# EAGLE design two electrode ECG (EAGLE 7.4.0)
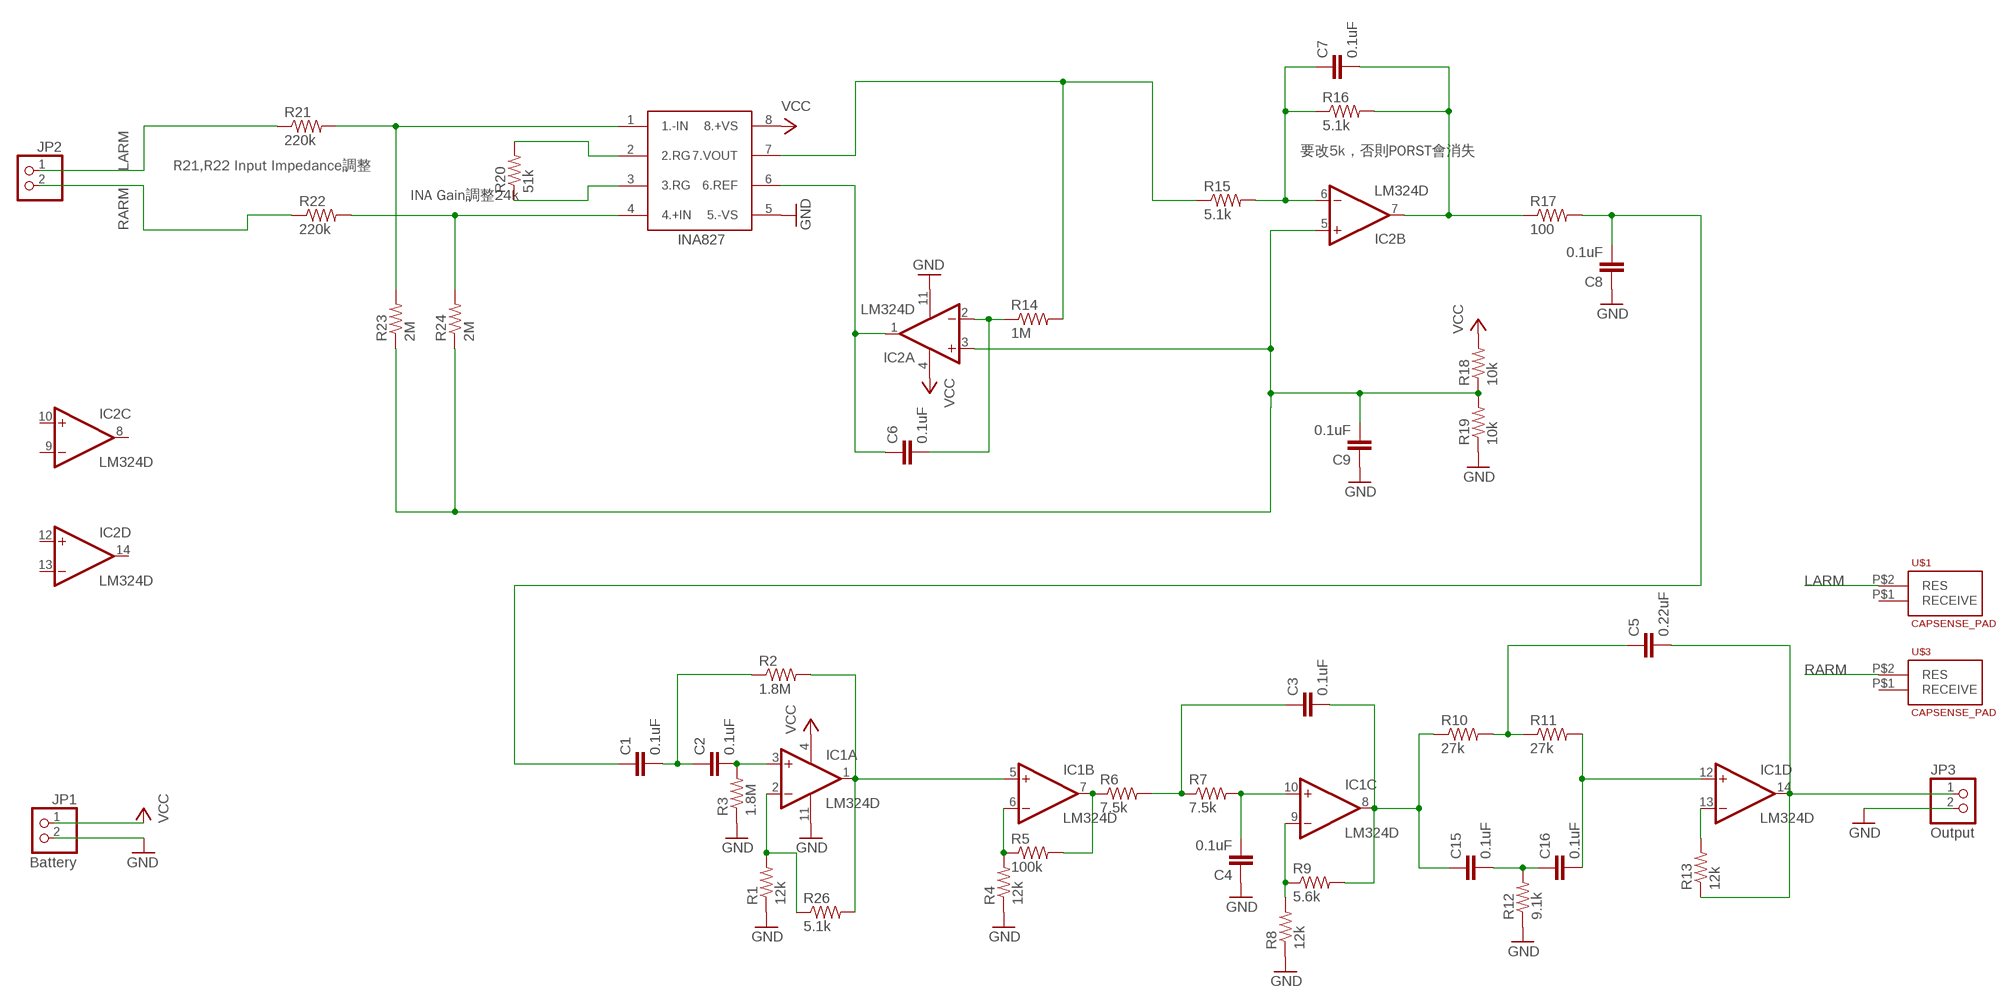
[diagram p0: schematic, sheet 1]

## Parts
C1  0.1uF  0.22UF-25V-10%(0603)  [0603-CAP]
C2  0.1uF  0.22UF-25V-10%(0603)  [0603-CAP]
C3  0.1uF  0.22UF-25V-10%(0603)  [0603-CAP]
C4  0.1uF  0.22UF-25V-10%(0603)  [0603-CAP]
C5  0.22uF  0.22UF-25V-10%(0603)  [0603-CAP]
C6  0.1uF  0.22UF-25V-10%(0603)  [0603-CAP]
C7  0.1uF  0.22UF-25V-10%(0603)  [0603-CAP]
C8  0.1uF  0.22UF-25V-10%(0603)  [0603-CAP]
C9  0.1uF  0.22UF-25V-10%(0603)  [0603-CAP]
C15  0.1uF  0.22UF-25V-10%(0603)  [0603-CAP]
C16  0.1uF  0.22UF-25V-10%(0603)  [0603-CAP]
IC1  LM324D  [SO14]
IC2  LM324D  [SO14]
JP1  Battery  PINHD-1X2  [1X02]
JP2  PINHD-1X2  [1X02]
JP3  Output  PINHD-1X2  [1X02]
R1  12k  1.2MOHMS-1/10W-1%(0603)  [0603-RES]
R2  1.8M  1.2MOHMS-1/10W-1%(0603)  [0603-RES]
R3  1.8M  1.2MOHMS-1/10W-1%(0603)  [0603-RES]
R4  12k  1.2MOHMS-1/10W-1%(0603)  [0603-RES]
R5  100k  1.2MOHMS-1/10W-1%(0603)  [0603-RES]
R6  7.5k  1.2MOHMS-1/10W-1%(0603)  [0603-RES]
R7  7.5k  1.2MOHMS-1/10W-1%(0603)  [0603-RES]
R8  12k  1.2MOHMS-1/10W-1%(0603)  [0603-RES]
R9  5.6k  1.2MOHMS-1/10W-1%(0603)  [0603-RES]
R10  27k  1.2MOHMS-1/10W-1%(0603)  [0603-RES]
R11  27k  1.2MOHMS-1/10W-1%(0603)  [0603-RES]
R12  9.1k  1.2MOHMS-1/10W-1%(0603)  [0603-RES]
R13  12k  1.2MOHMS-1/10W-1%(0603)  [0603-RES]
R14  1M  1.2MOHMS-1/10W-1%(0603)  [0603-RES]
R15  5.1k  1.2MOHMS-1/10W-1%(0603)  [0603-RES]
R16  5.1k  1.2MOHMS-1/10W-1%(0603)  [0603-RES]
R17  100  1.2MOHMS-1/10W-1%(0603)  [0603-RES]
R18  10k  1.2MOHMS-1/10W-1%(0603)  [0603-RES]
R19  10k  1.2MOHMS-1/10W-1%(0603)  [0603-RES]
R20  51k  1.2MOHMS-1/10W-1%(0603)  [0603-RES]
R21  220k  1.2MOHMS-1/10W-1%(0603)  [0603-RES]
R22  220k  1.2MOHMS-1/10W-1%(0603)  [0603-RES]
R23  2M  1.2MOHMS-1/10W-1%(0603)  [0603-RES]
R24  2M  1.2MOHMS-1/10W-1%(0603)  [0603-RES]
R26  5.1k  1.2MOHMS-1/10W-1%(0603)  [0603-RES]
U$1  CAPSENSE_PAD  [CAPSENSE_PAD]
U$2  INA827  [INA827]
U$3  CAPSENSE_PAD  [CAPSENSE_PAD]

## Nets
GND: C4.1 C8.1 C9.1 IC1.11(P:V-) IC2.11(P:V-) JP1.2 JP3.2 R1.1 R3.1 R4.1 R8.1 R12.1 R19.1 U$2.5(5.-VS)
LARM: JP2.1 R21.1 U$1.P$2(RES)
N$1: R20.2 U$2.2(2.RG)
N$2: C6.2 IC2.2(A:-IN) R14.1
N$3: R14.2 R15.1 U$2.7(7.VOUT)
N$4: C2.2 IC1.3(A:+IN) R3.2
N$5: R21.2 R23.2 U$2.1(1.-IN)
N$6: C1.2 C2.1 R2.1
N$7: IC1.1(A:OUT) IC1.5(B:+IN) R2.2 R26.2
N$8: IC1.2(A:-IN) R1.2 R26.1
N$9: C3.1 R6.2 R7.1
N$10: IC1.6(B:-IN) R4.2 R5.1
N$11: IC1.7(B:OUT) R5.2 R6.1
N$12: C4.2 IC1.10(C:+IN) R7.2
N$13: C3.2 C15.1 IC1.8(C:OUT) R9.2 R10.1
N$14: IC1.9(C:-IN) R8.2 R9.1
N$15: C5.1 R10.2 R11.1
N$16: C16.2 IC1.12(D:+IN) R11.2
N$17: C15.2 C16.1 R12.2
N$18: IC1.13(D:-IN) R13.2
N$19: C5.2 IC1.14(D:OUT) JP3.1 R13.1
N$20: C6.1 IC2.1(A:OUT) U$2.6(6.REF)
N$21: C7.1 IC2.6(B:-IN) R15.2 R16.1
N$22: C7.2 IC2.7(B:OUT) R16.2 R17.1
N$23: C1.1 C8.2 R17.2
N$24: C9.2 IC2.3(A:+IN) IC2.5(B:+IN) R18.1 R19.2 R23.1 R24.1
N$25: R20.1 U$2.3(3.RG)
N$26: R22.2 R24.2 U$2.4(4.+IN)
RARM: JP2.2 R22.1 U$3.P$2(RES)
VCC: IC1.4(P:V+) IC2.4(P:V+) JP1.1 R18.2 U$2.8(8.+VS)
Unconnected: IC2.8(C:OUT) IC2.9(C:-IN) IC2.10(C:+IN) IC2.12(D:+IN) IC2.13(D:-IN) IC2.14(D:OUT) U$1.P$1(RECEIVE) U$3.P$1(RECEIVE)

## Notes on the sheet
- 要改5k，否則PORST會消失
- R21,R22 Input Impedance調整
- INA Gain調整24k

## Library data of the parts
C1-C4 C6-C9 C15 C16 = SparkFun-Capacitors:0.22UF-25V-10%(0603): CAP-07822; PROD_ID: CAP-07822; VALUE: 0.22uF
C5 = SparkFun-Capacitors:0.22UF-25V-10%(0603): CAP-07822; PROD_ID: CAP-07822
IC1 IC2 = linear:LM324: OP AMP
JP1-JP3 = pinhead:PINHD-1X2: PIN HEADER
R1-R24 R26 = SparkFun-Resistors:1.2MOHMS-1/10W-1%(0603): RES-10055; PROD_ID: RES-10055; VALUE: 1.2M
U$1 U$3 = SparkFun-Electromechanical:CAPSENSE_PAD: Generic copper pad for a capacitive touch sensor.
U$2 = INA827:INA827

## Board
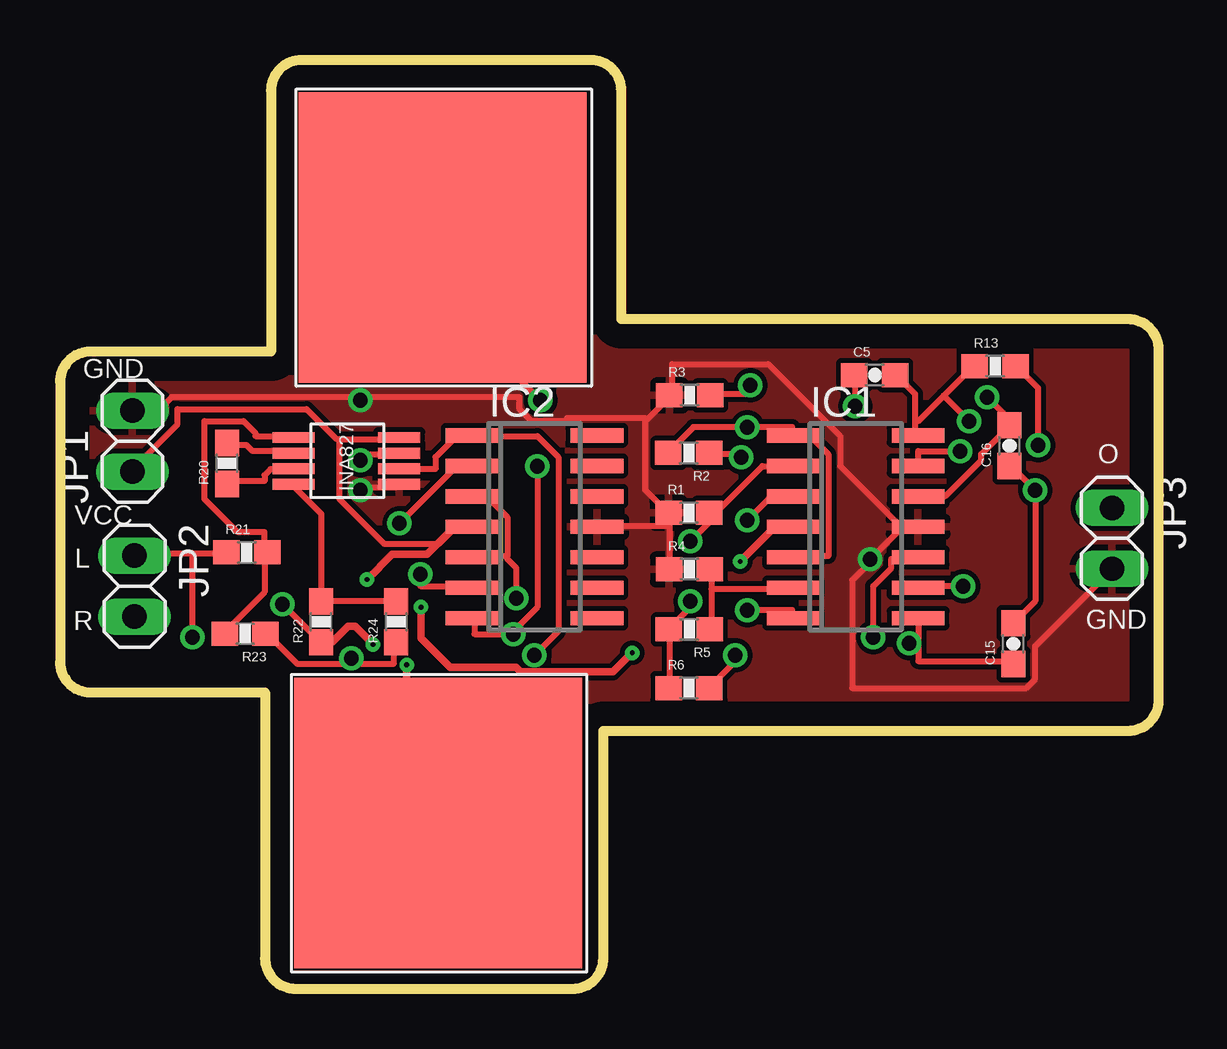
[diagram p1: board, top side]
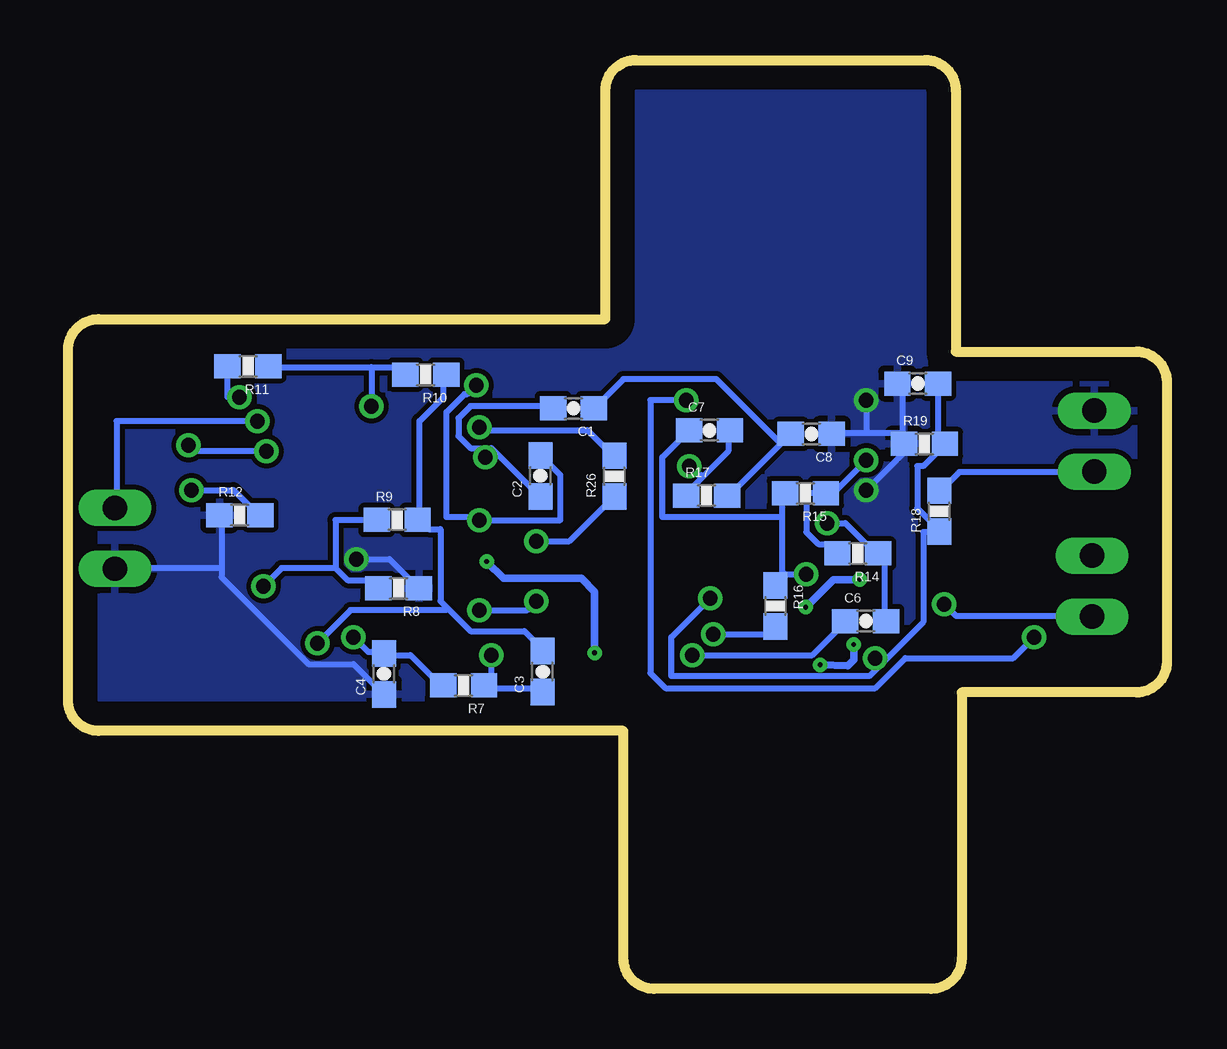
[diagram p2: board, bottom side, seen from below]

Size 45.8 x 38.7 mm. Coordinates in mm from the lower left corner, seen from the top.
Outline: 0,25.28 0,13.62 arc90 1.27,12.35 8.55,12.35 8.55,1.27 arc90 9.82,0 21.38,0 arc90 22.65,1.27 22.65,10.75 44.53,10.75 arc90 45.8,12.02 45.8,26.63 arc90 44.53,27.9 23.4,27.9 23.4,37.43 arc90 22.13,38.7 10.07,38.7 arc90 8.8,37.43 8.8,26.55 1.27,26.55 arc90 0,25.28
Copper layers (1*16): Top 0.035mm / dielectric 1.5mm / Bottom 0.035mm
Design rules "default": minimum track width 10mil, minimum drill 24mil, track to track 8mil, track to pad 8mil, pad to pad 8mil, via to via 8mil, smd to smd 8mil, copper to edge 40mil, drill to drill 8mil, minimum pad ring 10mil, minimum via ring 8mil, stop-mask expansion 4mil, vias tented up to drill 0mil, thermal gap 10mil

### Footprints (pad centres in the part's own frame; a part is rotated, then mirrored left to right if it is on the bottom)
0603-CAP = smd 1.1 x 1: 1 -0.85,0; 2 0.85,0
SO14 = smd 0.6 x 2.2: 1 -3.81,-2.6; 2 -2.54,-2.6; 3 -1.27,-2.6; 4 0,-2.6; 5 1.27,-2.6; 6 2.54,-2.6; 7 3.81,-2.6; 8 3.81,2.6; 9 2.54,2.6; 10 1.27,2.6; 11 0,2.6; 12 -1.27,2.6; 13 -2.54,2.6; 14 -3.81,2.6
1X02 = drill 1.016 long: 1 -1.27,0; 2 1.27,0
0603-RES = smd 1.1 x 1: 1 -0.85,0; 2 0.85,0
CAPSENSE_PAD = smd 12 x 6.1: P$1 0,3; P$2 0,-3
INA827 = smd 1.75 x 0.45: 1 -3,3; 2 -3,2.35; 3 -3,1.7; 4 -3,1.05; 5 1.4,1.05; 6 1.4,1.7; 7 1.4,2.35; 8 1.4,3

### Placement (x,y rotation side)
C1  24.73,24.19 180 bottom
C2  26.11,21.37 90 bottom
C3  26.02,13.22 90 bottom
C4  32.63,13.12 90 bottom
C5  33.96,25.57 0 top
C6  12.55,15.32 0 bottom
C7  19.06,23.27 0 bottom
C8  14.82,23.12 180 bottom
C9  10.38,25.22 0 bottom
C15  39.74,14.38 90 top
C16  39.58,22.63 90 top
IC1  33.17,19.25 270 top
IC2  19.78,19.25 270 top
JP1  3.02,22.82 90 top
JP2  3.11,16.78 270 top
JP3  43.85,18.77 270 top
R1  26.22,19.83 0 top
R2  26.21,22.33 180 top
R3  26.25,24.73 0 top
R4  26.24,17.48 0 top
R5  26.23,14.98 180 top
R6  26.22,12.53 0 top
R7  29.31,12.64 180 bottom
R8  32.02,16.69 180 bottom
R9  32.08,19.54 0 bottom
R10  30.89,25.59 180 bottom
R11  38.3,25.94 180 bottom
R12  38.64,19.74 0 bottom
R13  38.98,25.94 0 top
R14  12.88,18.14 180 bottom
R15  15.06,20.65 180 bottom
R16  16.32,15.95 270 bottom
R17  19.18,20.55 0 bottom
R18  9.49,19.9 90 bottom
R19  10.1,22.7 0 bottom
R20  6.96,21.89 90 top
R21  7.79,18.18 0 top
R22  10.89,15.29 90 top
R23  7.72,14.8 180 top
R24  14.02,15.29 90 top
R26  23.03,21.36 90 bottom
U$1  15.95,31.3 0 top
U$2  12.74,19.97 0 top
U$3  15.75,6.9 0 top

### Tracks (layer width: path | path; a pad name or v marks a point on that pad's centre or on a via)
GND  (via drill 0.61)
  Top 0.254: v12.52,20.77 12.52,20.9 14.02,20.9 U$2.5 | 25.4,19.27 25.4,19.77 R1.1 25.27,19.9 24.4,20.77 24.4,23.65 24.46,23.71 | 25.4,19.27 25.4,17.52 R4.1 | 24.46,23.71 25.4,24.65 R3.1 25.52,24.77 25.52,26.02 29.52,26.02 32.52,23.02 32.52,21.77 35.02,19.27 IC1.11 35.65,19.15 35.02,19.15 v33.77,17.9 33.77,17.77 33.02,17.02 33.02,12.53 40.27,12.53 40.65,12.9 40.65,14.28 43.77,17.4 JP3.2 | 25.4,19.27 22.4,19.27 IC2.11 | 12.52,24.65 19.15,24.65 19.15,24.15 19.65,23.65 21.02,23.65 21.15,23.77 24.4,23.77 24.46,23.71 | 12.52,24.65 4.65,24.65 4.4,24.4 4.4,24.15 3.02,24.15 JP1.2 | v12.52,24.52 12.52,24.65
  Bottom 0.254: 39.4,17.52 39.4,19.65 R12.1 | 39.4,17.52 39.4,17.15 35.77,13.53 33.9,13.53 32.65,12.28 C4.1 | 39.4,17.52 43.77,17.52 JP3.2 | v33.77,17.9 32.4,17.9 31.27,16.77 R8.1 | R19.1 11.02,22.77 11.02,25.15 11.15,25.15 C9.1 | 12.52,23.15 11.15,23.15 R19.1 | 12.52,23.15 13.9,23.15 C8.1 | v12.52,20.77 11.02,22.27 11.02,22.65 R19.1 | v12.52,24.52 12.52,23.15
  pour Bottom: 9.8,38.55 22.8,38.55 23.4,37.95 23.4,28.35 23.8,27.95 44.8,27.95 45.8,26.95 45.8,11.35 45,10.55 24,10.55 23,9.55 23,0.95 21.8,-0.25 9.8,-0.25 8.4,1.15 8.4,11.55 7.6,12.35 1,12.35 0,13.35 0,25.35 1.2,26.55 8,26.55 8.8,27.35 8.8,37.55
  pour Top: 9.8,38.55 22.8,38.55 23.4,37.95 23.4,28.15 23.6,27.95 44.8,27.95 45.8,26.95 45.8,11.35 45,10.55 24,10.55 23,9.55 23,0.95 21.8,-0.25 9.8,-0.25 8.4,1.15 8.4,11.55 7.6,12.35 1,12.35 0,13.35 0,25.35 1.2,26.55 8,26.55 8.8,27.35 8.8,37.55
LARM  (via drill 0.61)
  Top 0.254: 5.52,18.15 3.15,18.15 JP2.1 | 5.52,18.15 6.9,18.15 R21.1 | v5.52,14.65 5.52,18.15 | v20.02,24.52 16.27,28.27 16.02,28.27 U$1.P$2
  Bottom 0.254: v5.52,14.65 6.4,13.78 10.9,13.78 12.15,12.53 20.9,12.53 21.52,13.15 21.52,24.52 v20.02,24.52
N$1
  Top 0.254: R20.2 7.02,22.65 7.77,22.65 8.02,22.4 9.65,22.4 U$2.2
N$2  (via drill 0.61)
  Top 0.254: v14.15,19.4 16.52,21.77 17.15,21.77 IC2.2
  Bottom 0.254: C6.2 11.77,15.4 11.77,18.02 12.02,18.02 R14.1 12.15,18.15 13.4,19.4 v14.15,19.4
N$3  (via drill 0.61)
  Top 0.254: v12.52,22.02 12.52,22.27 14.02,22.27 U$2.7
  Bottom 0.254: R14.2 13.77,18.15 14.15,18.52 14.52,18.52 15.02,19.02 15.02,20.65 R15.1 13.9,20.65 v12.52,22.02
N$4  (via drill 0.61)
  Top 0.254: v28.65,19.52 29.52,20.4 30.52,20.4 IC1.3 | v28.77,25.15 28.77,24.77 27.15,24.77 R3.2
  Bottom 0.254: C2.2 26.02,22.15 25.27,21.4 25.27,19.52 v28.65,19.52 28.65,19.65 30.02,19.65 30.02,24.02 29.27,24.77 29.15,24.77 v28.77,25.15
N$5
  Top 0.254: R23.2 6.9,14.9 8.52,16.52 8.52,18.15 R21.2 8.52,18.27 8.52,19.02 7.4,19.02 6.02,20.4 6.02,23.65 7.65,23.65 8.15,23.15 8.15,23.02 9.65,23.02 U$2.1
N$6  (via drill 0.61)
  Top 0.254: v28.4,22.15 28.4,22.27 27.15,22.27 R2.1
  Bottom 0.254: 28.4,22.52 29.02,22.52 29.52,23.02 29.52,23.77 29.02,24.27 25.65,24.27 C1.2 | 28.4,22.52 28.15,22.52 26.15,20.52 C2.1 | 28.4,22.52 v28.4,22.15
N$7  (via drill 0.61)
  Top 0.254: R2.2 25.4,22.4 26.4,23.4 v28.65,23.4 30.52,23.4 30.52,23.15 IC1.1 30.65,23.02 31.27,23.02 32.02,22.27 32.02,18.02 30.65,18.02 IC1.5
  Bottom 0.254: v28.65,23.4 28.52,23.27 24.15,23.27 23.15,22.27 R26.2
N$8  (via drill 0.61)
  Top 0.254: v26.27,18.65 27.02,19.4 27.02,19.77 R1.2 27.15,19.65 29.27,21.77 30.52,21.77 IC1.2
  Bottom 0.254: v26.27,18.65 24.9,18.65 23.15,20.4 R26.1
N$9  (via drill 0.61)
  Top 0.254: v28.15,13.9 28.15,13.65 27.15,12.65 R6.2
  Bottom 0.254: C3.1 26.02,12.4 26.15,12.53 28.4,12.53 R7.1 28.15,12.65 v28.15,13.9
N$10
  Top 0.254: 27.15,16.65 27.15,17.4 R4.2 | 27.15,16.65 27.15,15.03 R5.1 | 27.15,16.65 30.52,16.65 IC1.6
N$11  (via drill 0.61)
  Top 0.254: R6.1 25.4,12.65 25.4,14.9 R5.2 25.4,15.03 26.27,15.9 v26.27,16.15 | v28.65,15.78 30.52,15.78 30.52,15.53 IC1.7
  Bottom 0.254: v26.27,16.15 26.65,15.78 v28.65,15.78
N$12  (via drill 0.61)
  Top 0.254: v33.9,14.65 33.9,16.77 34.65,17.52 34.65,17.9 35.65,17.9 IC1.10
  Bottom 0.254: R7.2 30.27,12.65 31.52,13.9 32.52,13.9 C4.2 32.65,14.03 33.27,14.03 v33.9,14.65
N$13  (via drill 0.61)
  Top 0.254: 35.77,14.4 35.77,15.4 IC1.8 | 35.77,14.4 35.77,13.65 39.65,13.65 C15.1 | v35.4,14.4 35.77,14.4
  Bottom 0.254: 29.96,15.84 30.27,16.15 30.27,19.15 30.77,19.15 31.15,19.52 R9.2 31.15,19.65 31.15,23.65 30.15,24.65 30.15,25.52 R10.1 | 29.96,15.84 29.02,14.9 26.77,14.9 26.02,14.15 C3.2 | v35.4,14.4 34.02,15.78 30.02,15.78 29.96,15.84
N$14  (via drill 0.61)
  Top 0.254: v37.65,16.77 35.77,16.77 IC1.9
  Bottom 0.254: 34.65,17.52 34.15,17.02 33.15,17.02 32.9,16.77 R8.2 | 34.65,17.52 34.65,19.52 33.02,19.52 R9.1 | v37.65,16.77 36.9,17.52 34.65,17.52
N$15  (via drill 0.61)
  Top 0.254: v33.15,24.27 33.15,25.52 C5.1
  Bottom 0.254: 33.15,25.9 37.4,25.9 R11.1 | 33.15,25.9 32.02,25.9 31.77,25.65 R10.2 | 33.15,25.9 v33.15,24.27
N$16  (via drill 0.61)
  Top 0.254: IC1.12 36.9,20.52 38.4,22.02 38.4,22.27 39.52,23.4 C16.2 39.52,23.52 39.52,23.77 v38.65,24.65
  Bottom 0.254: R11.2 39.15,24.65 v38.65,24.65
N$17  (via drill 0.61)
  Top 0.254: C16.1 39.65,21.77 v40.65,20.77 40.65,16.15 39.77,15.28 C15.2
  Bottom 0.254: v40.65,20.77 38.9,20.77 37.9,19.77 R12.2
N$18  (via drill 0.61)
  Top 0.254: v40.77,22.65 40.77,25.02 39.9,25.9 R13.2 | v37.52,22.4 35.77,22.4 35.77,21.9 IC1.13
  Bottom 0.254: v40.77,22.65 40.52,22.4 v37.52,22.4
N$19  (via drill 0.61)
  Top 0.254: 35.65,23.65 35.65,23.15 IC1.14 | 35.65,23.65 35.65,24.77 34.9,25.52 C5.2 | 36.84,24.71 35.77,23.65 35.65,23.65 | 36.84,24.71 38.02,25.9 R13.1 | 36.84,24.71 v37.9,23.65
  Bottom 0.254: v37.9,23.65 43.77,23.65 43.77,20.15 JP3.1
N$20  (via drill 0.61)
  Top 0.254: v19.77,13.9 20.77,14.9 20.77,22.15 19.9,23.02 17.27,23.02 IC2.1 17.15,23.02 16.52,23.02 15.65,22.15 15.65,21.65 14.15,21.65 U$2.6
  Bottom 0.254: v19.77,13.9 14.77,13.9 13.4,15.28 C6.1
N$21  (via drill 0.61)
  Top 0.254: v15.02,17.27 15.02,16.77 17.15,16.77 IC2.6
  Bottom 0.254: 16.02,19.65 16.02,16.9 16.27,16.9 R16.1 15.9,17.27 v15.02,17.27 | 16.02,19.65 16.02,20.65 R15.2 | 16.02,19.65 21.02,19.65 21.02,22.15 20.02,23.15 C7.1
N$22  (via drill 0.61)
  Top 0.254: IC2.7 17.27,15.4 17.27,14.78 v18.9,14.78 18.9,14.9 19.9,15.9 v19.9,21.77
  Bottom 0.254: v18.9,14.78 16.65,14.78 16.4,15.03 R16.2 | 19.34,21.34 18.27,22.4 18.27,23.15 C7.2 | 19.34,21.34 20.02,20.65 R17.1 | v19.9,21.77 19.52,21.4 19.4,21.4 19.34,21.34
N$23
  Bottom 0.254: R17.2 18.27,20.65 18.15,20.65 15.77,23.02 C8.2 16.15,22.77 18.77,25.4 22.65,25.4 23.77,24.27 C1.1
N$24  (via drill 0.61)
  Top 0.254: 12.15,13.53 13.9,13.53 13.9,14.4 R24.1 | 12.15,13.53 9.9,13.53 8.65,14.78 R23.1 | 18.65,18.02 17.27,18.02 IC2.5 | 18.65,18.02 18.65,19.65 17.9,20.4 17.27,20.4 IC2.3 | v19.02,16.27 19.02,17.52 18.65,17.9 18.65,18.02 | v12.15,13.78 12.15,13.53
  Bottom 0.254: C9.2 9.52,25.15 9.52,22.77 9.27,22.77 R19.2 9.27,22.65 10.15,21.77 10.4,21.77 10.4,20.02 9.52,19.15 R18.1 9.52,19.02 10.15,19.02 10.15,15.28 11.84,13.59 | v19.02,16.27 20.65,14.65 20.65,13.03 12.4,13.03 11.84,13.59 | v12.15,13.78 12.02,13.65 11.9,13.65 11.84,13.59
N$25
  Top 0.254: R20.1 7.02,21.15 8.52,21.15 8.52,21.4 8.77,21.65 9.65,21.65 U$2.3
N$26
  Top 0.254: R24.2 13.9,16.15 R22.2 10.9,16.27 10.9,19.77 9.77,20.9 U$2.4
RARM  (via drill 0.2 pad 0.3, 0.61)
  Top 0.254: v9.27,16.02 10.77,14.53 R22.1
  Top 0.305: R22.1 11.34,14.44 12,15.1 12.3,15.1 v13.05,14.35 | v14.45,13.5 14.55,5.1 U$3.P$2
  Bottom 0.254: v9.27,16.02 8.77,15.53 3.15,15.53 JP2.2
  Bottom 0.305: v13.05,14.35 13.05,13.7 13.3,13.45 v14.45,13.5
VCC  (via drill 0.2 pad 0.3)
  Top 0.254: 11.65,22.9 14.02,22.9 U$2.8 | 11.65,22.9 11.65,20.4 13.52,18.52 15.77,18.52 16.4,19.15 17.15,19.15 IC2.4 | 11.65,22.9 11.52,22.9 10.27,24.15 4.9,24.15 4.9,23.52 3.02,21.65 JP1.1
  Top 0.305: IC2.4 16.45,19.25 15.3,18.1 13.85,18.1 v12.8,17.05 | v15.05,15.9 15.05,14.6 16.25,13.4 19,13.4 19.2,13.2 23.05,13.2 v23.85,14 | v28.35,17.8 29.65,19.1 30.42,19.1 IC1.4
  Bottom 0.254: R18.2 9.4,20.77 8.65,21.52 3.02,21.52 JP1.1
  Bottom 0.305: v12.8,17.05 13.9,17.05 v15.05,15.9 | v23.85,14 23.85,16.55 24.4,17.1 27.65,17.1 v28.35,17.8

### Text on the board
tPlace: GND | O | VCC | L | R | GND